# EAGLE design schachzwerg (EAGLE 7.6.0)
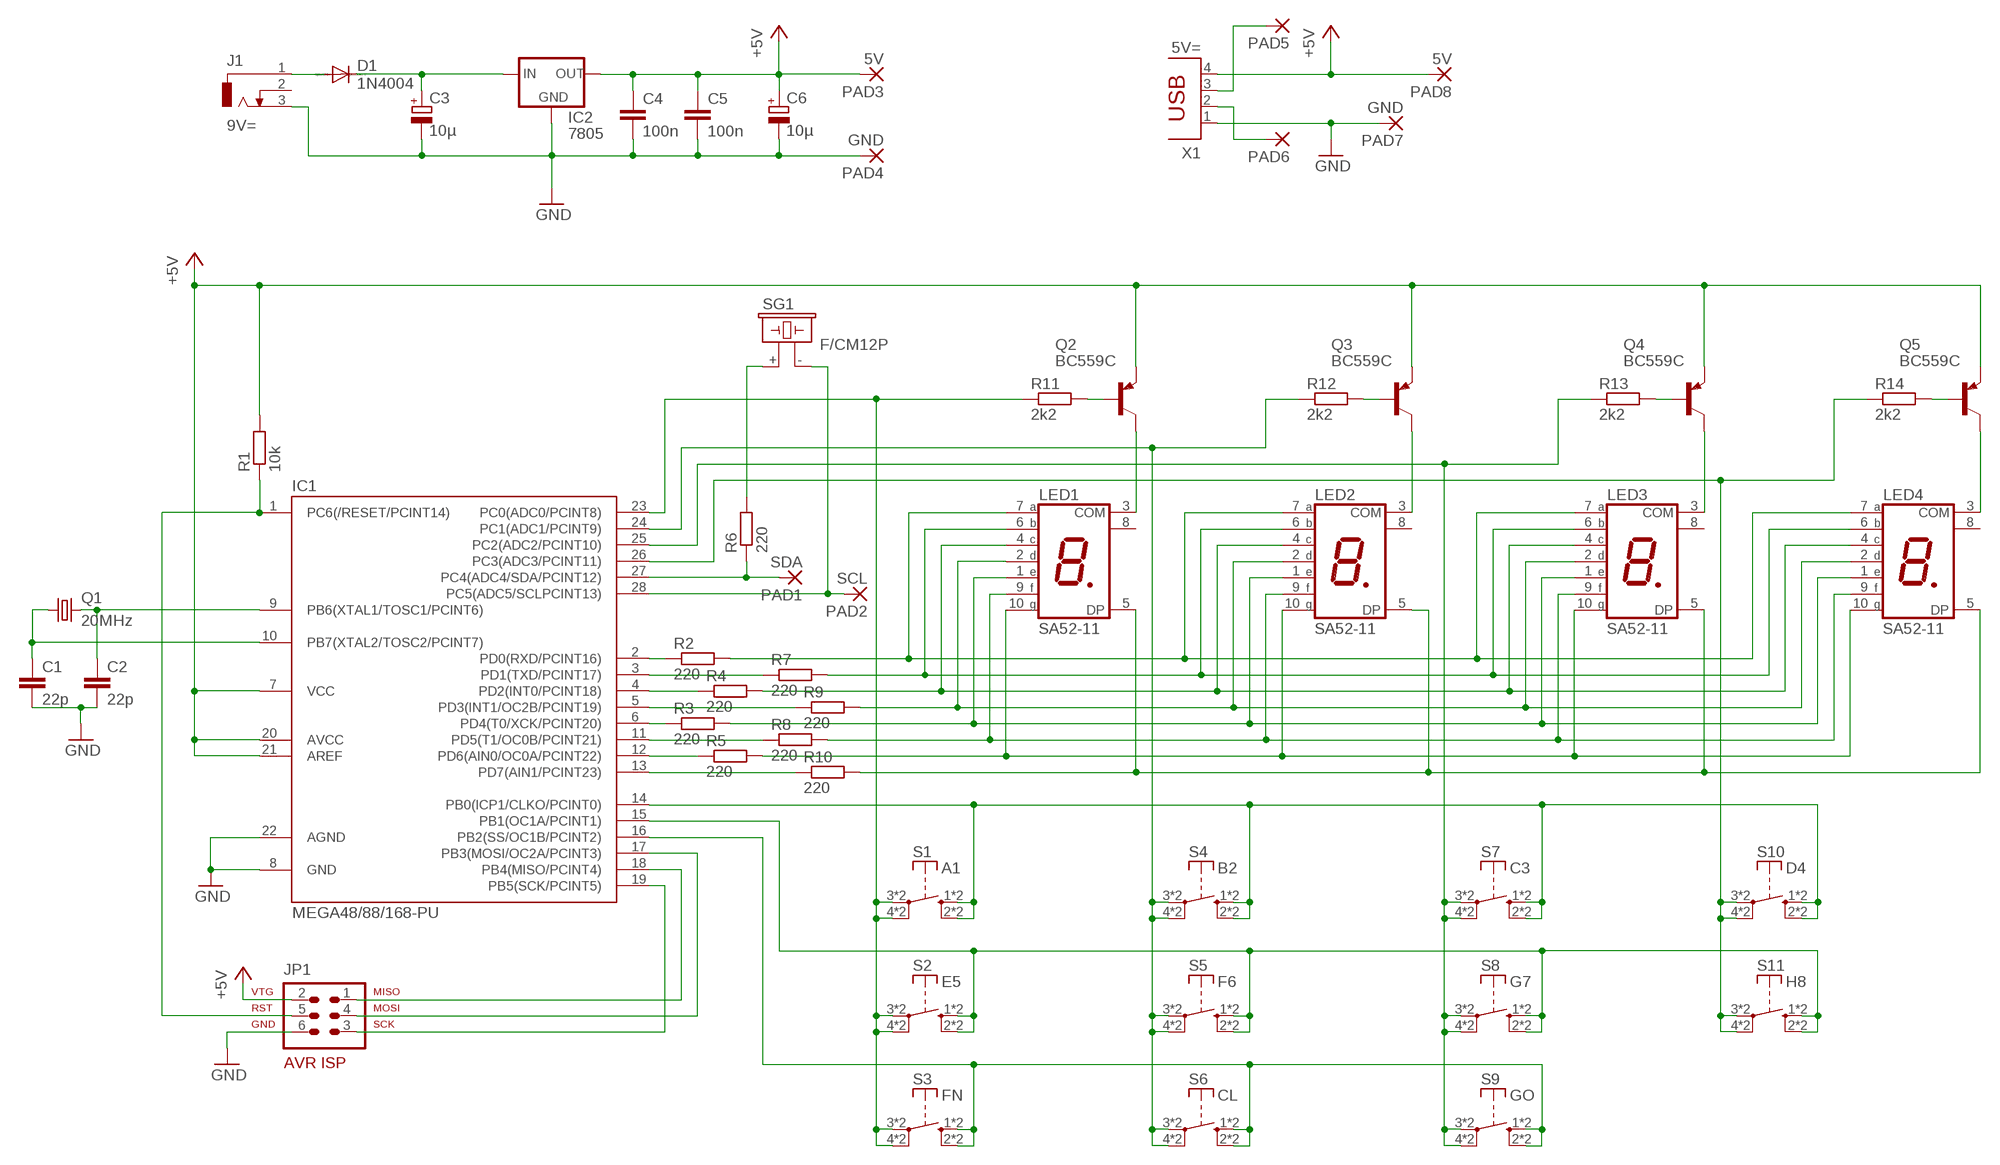
[diagram p0: schematic, sheet 1]

## Parts
C1  22p  C-EU025-025X050  [C025-025X050]
C2  22p  C-EU025-025X050  [C025-025X050]
C3  10µ  CPOL-EUE2.5-5  [E2,5-5]
C4  100n  C-EU025-025X050  [C025-025X050]
C5  100n  C-EU025-025X050  [C025-025X050]
C6  10µ  CPOL-EUE2.5-5  [E2,5-5]
D1  1N4004  [DO41-10]
IC1  MEGA48/88/168-PU  [DIL28-3]
IC2  7805  78XXS  [78XXS]
J1  9V=  DCJ0303  [DCJ0303]
JP1  AVR-ISP-6  [AVR-ISP-6]
LED1  SA52-11  7-SEG_SA52-11  [SA52-11]
LED2  SA52-11  7-SEG_SA52-11  [SA52-11]
LED3  SA52-11  7-SEG_SA52-11  [SA52-11]
LED4  SA52-11  7-SEG_SA52-11  [SA52-11]
PAD1  SDA  1,6/0,8  [1,6/0,8]
PAD2  SCL  1,6/0,8  [1,6/0,8]
PAD3  5V  1,6/0,8  [1,6/0,8]
PAD4  GND  1,6/0,8  [1,6/0,8]
PAD5  1,6/0,8  [1,6/0,8]
PAD6  1,6/0,8  [1,6/0,8]
PAD7  GND  1,6/0,8  [1,6/0,8]
PAD8  5V  1,6/0,8  [1,6/0,8]
Q1  20MHz  CRYSTALHC49S  [HC49/S]
Q2  BC559C  [TO92-EBC]
Q3  BC559C  [TO92-EBC]
Q4  BC559C  [TO92-EBC]
Q5  BC559C  [TO92-EBC]
R1  10k  R-EU_0204/7  [0204/7]
R2  220  R-EU_0204/7  [0204/7]
R3  220  R-EU_0204/7  [0204/7]
R4  220  R-EU_0204/7  [0204/7]
R5  220  R-EU_0204/7  [0204/7]
R6  220  R-EU_0204/7  [0204/7]
R7  220  R-EU_0204/7  [0204/7]
R8  220  R-EU_0204/7  [0204/7]
R9  220  R-EU_0204/7  [0204/7]
R10  220  R-EU_0204/7  [0204/7]
R11  2k2  R-EU_0204/7  [0204/7]
R12  2k2  R-EU_0204/7  [0204/7]
R13  2k2  R-EU_0204/7  [0204/7]
R14  2k2  R-EU_0204/7  [0204/7]
S1  A1  DT6  [DT6]
S2  E5  DT6  [DT6]
S3  FN  DT6  [DT6]
S4  B2  DT6  [DT6]
S5  F6  DT6  [DT6]
S6  CL  DT6  [DT6]
S7  C3  DT6  [DT6]
S8  G7  DT6  [DT6]
S9  GO  DT6  [DT6]
S10  D4  DT6  [DT6]
S11  H8  DT6  [DT6]
SG1  F/CM12P  [F/CM12P]
X1  5V=  PN87520  [PN87520]

## Nets
+5V: C4.1 C5.1 C6.+ IC1.7(VCC) IC1.20(AVCC) IC1.21(AREF) IC2.OUT JP1.2 PAD3.1(P) PAD8.1(P) Q2.E Q3.E Q4.E Q5.E R1.2 X1.4
GND: C1.2 C2.2 C3.- C4.2 C5.2 C6.- IC1.8(GND) IC1.22(AGND) IC2.GND J1.3 JP1.6 PAD4.1(P) PAD7.1(P) X1.1
N$1: IC1.2(PD0(RXD/PCINT16)) R2.1
N$2: IC1.3(PD1(TXD/PCINT17)) R7.1
N$3: IC1.4(PD2(INT0/PCINT18)) R4.1
N$4: IC1.5(PD3(INT1/OC2B/PCINT19)) R9.1
N$5: IC1.6(PD4(T0/XCK/PCINT20)) R3.1
N$6: IC1.11(PD5(T1/OC0B/PCINT21)) R8.1
N$7: IC1.12(PD6(AIN0/OC0A/PCINT22)) R5.1
N$8: IC1.13(PD7(AIN1/PCINT23)) R10.1
N$9: LED1.7(A) LED2.7(A) LED3.7(A) LED4.7(A) R2.2
N$10: LED1.6(B) LED2.6(B) LED3.6(B) LED4.6(B) R7.2
N$11: LED1.4(C) LED2.4(C) LED3.4(C) LED4.4(C) R4.2
N$12: LED1.2(D) LED2.2(D) LED3.2(D) LED4.2(D) R9.2
N$13: LED1.1(E) LED2.1(E) LED3.1(E) LED4.1(E) R3.2
N$14: LED1.9(F) LED2.9(F) LED3.9(F) LED4.9(F) R8.2
N$15: LED1.10(G) LED2.10(G) LED3.10(G) LED4.10(G) R5.2
N$16: LED1.5(DP) LED2.5(DP) LED3.5(DP) LED4.5(DP) R10.2
N$17: LED1.3(COM) Q2.C
N$18: LED2.3(COM) Q3.C
N$19: LED3.3(COM) Q4.C
N$20: LED4.3(COM) Q5.C
N$21: Q2.B R11.2
N$22: Q3.B R12.2
N$23: Q4.B R13.2
N$24: Q5.B R14.2
N$25: C2.1 IC1.9(PB6(XTAL1/TOSC1/PCINT6)) Q1.2
N$26: PAD6.1(P) X1.2
N$27: R6.2 SG1.+
N$28: IC1.28(PC5(ADC5/SCLPCINT13)) PAD2.1(P) SG1.-
N$29: D1.A J1.1
N$30: IC1.1(PC6(/RESET/PCINT14)) JP1.5 R1.1
N$31: IC1.19(PB5(SCK/PCINT5)) JP1.3
N$32: IC1.17(PB3(MOSI/OC2A/PCINT3)) JP1.4
N$33: IC1.18(PB4(MISO/PCINT4)) JP1.1
N$34: IC1.23(PC0(ADC0/PCINT8)) R11.1 S1.3(P) S1.4(P) S1.7(P) S1.8(P) S2.3(P) S2.4(P) S2.7(P) S2.8(P) S3.3(P) S3.4(P) S3.7(P) S3.8(P)
N$35: IC1.24(PC1(ADC1/PCINT9)) R12.1 S4.3(P) S4.4(P) S4.7(P) S4.8(P) S5.3(P) S5.4(P) S5.7(P) S5.8(P) S6.3(P) S6.4(P) S6.7(P) S6.8(P)
N$36: IC1.25(PC2(ADC2/PCINT10)) R13.1 S7.3(P) S7.4(P) S7.7(P) S7.8(P) S8.3(P) S8.4(P) S8.7(P) S8.8(P) S9.3(P) S9.4(P) S9.7(P) S9.8(P)
N$37: IC1.26(PC3(ADC3/PCINT11)) R14.1 S10.3(P) S10.4(P) S10.7(P) S10.8(P) S11.3(P) S11.4(P) S11.7(P) S11.8(P)
N$38: IC1.14(PB0(ICP1/CLKO/PCINT0)) S1.1(S) S1.2(S) S1.5(S) S1.6(S) S4.1(S) S4.2(S) S4.5(S) S4.6(S) S7.1(S) S7.2(S) S7.5(S) S7.6(S) S10.1(S) S10.2(S) S10.5(S) S10.6(S)
N$39: PAD5.1(P) X1.3
N$40: IC1.15(PB1(OC1A/PCINT1)) S2.1(S) S2.2(S) S2.5(S) S2.6(S) S5.1(S) S5.2(S) S5.5(S) S5.6(S) S8.1(S) S8.2(S) S8.5(S) S8.6(S) S11.1(S) S11.2(S) S11.5(S) S11.6(S)
N$41: IC1.16(PB2(SS/OC1B/PCINT2)) S3.1(S) S3.2(S) S3.5(S) S3.6(S) S6.1(S) S6.2(S) S6.5(S) S6.6(S) S9.1(S) S9.2(S) S9.5(S) S9.6(S)
N$42: C3.+ D1.C IC2.IN
N$43: C1.1 IC1.10(PB7(XTAL2/TOSC2/PCINT7)) Q1.1
N$45: IC1.27(PC4(ADC4/SDA/PCINT12)) PAD1.1(P) R6.1
Unconnected: J1.2 LED1.8(COM) LED2.8(COM) LED3.8(COM) LED4.8(COM)

## Library data of the parts
C1 C2 C4 C5 = rcl:C-EU: CAPACITOR, European symbol
C3 C6 = rcl:CPOL-EU: POLARIZED CAPACITOR, European symbol
D1 = diode:1N4004: DIODE general purpose rectifier, 1 A
IC1 = avr-5-4.16:MEGA48/88/168-PU
IC2 = v-reg:78XXS: VOLTAGE REGULATOR
J1 = con-jack:DCJ0303: DC POWER JACK Source: DCJ0303.pdf; OC_FARNELL: unknown; OC_NEWARK: unknown
JP1 = avr-5-4.16:AVR-ISP-6: AVR ISP-6 Serial Programming Header
LED1-LED4 = display-kingbright:7-SEG_: Kingbright 14.2mm (0.56 INCH) SINGLE DIGIT NUMERIC DUISPLAY Source: SA56-11EWA(Ver1189471036.pdf; OC_FARNELL: unknown; OC_NEWARK: unknown
PAD1-PAD8 = wirepad:1,6/0,8: THROUGH-HOLE PAD
Q1 = crystal:CRYSTAL: CRYSTAL; OC_FARNELL: 1667008; OC_NEWARK: unknown
Q2-Q5 = transistor-pnp:BC559*: PNP Transistror
R1-R14 = rcl:R-EU_: RESISTOR, European symbol
S1-S11 = switch-misc:DT: ITT SWITCH
SG1 = buzzer:F/CM12P: BUZZER Source: Buerklin; OC_FARNELL: unknown; OC_NEWARK: unknown
X1 = con-berg:PN87520: BERG USB connector; OC_FARNELL: unknown; OC_NEWARK: unknown

## Board
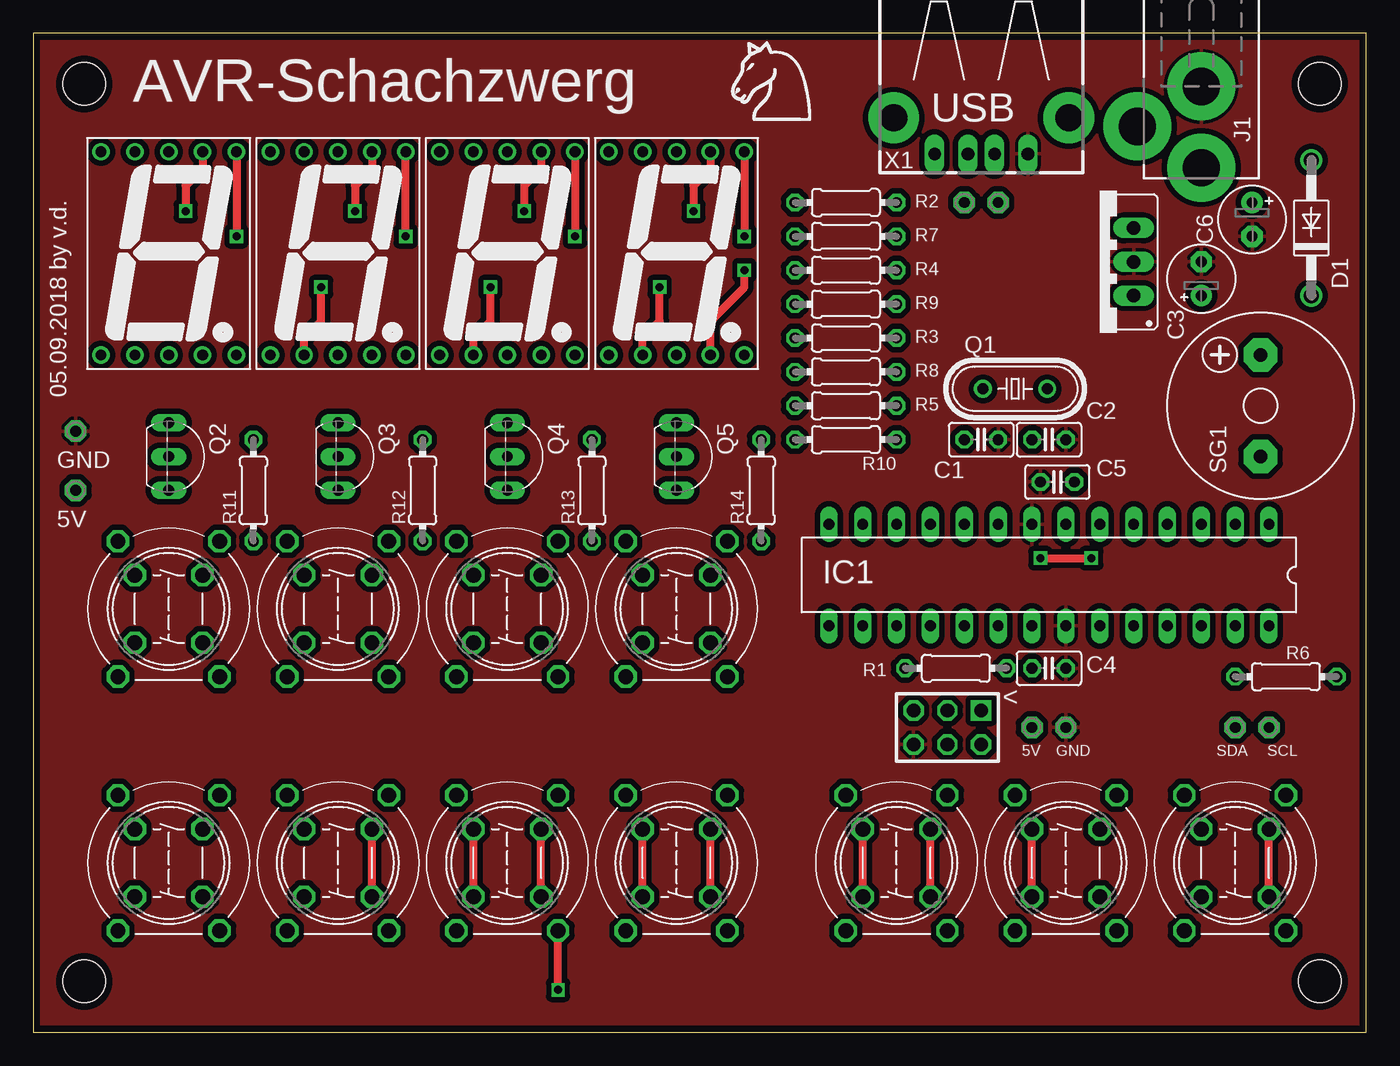
[diagram p1: board, top side]
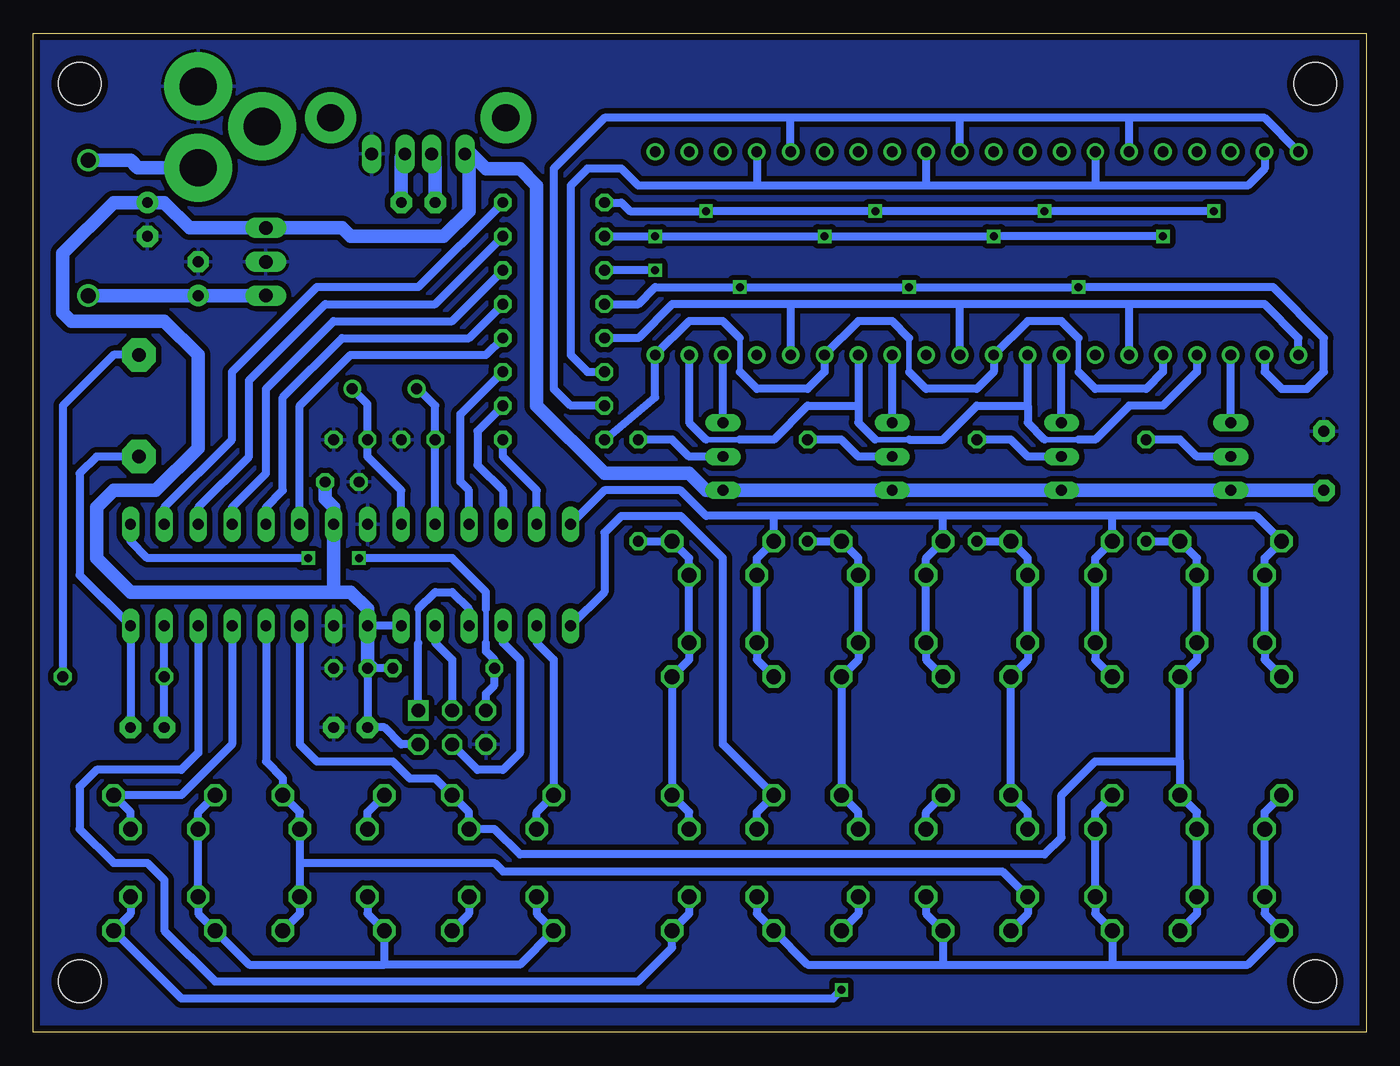
[diagram p2: board, bottom side, seen from below]

Size 100 x 74.92 mm. Coordinates in mm from the lower left corner, seen from the top.
Outline: 0,0 100,0 100,74.92 0,74.92 0,0
Copper layers (1*16): Top 0.035mm / dielectric 1.5mm / Bottom 0.035mm
Design rules "default *": minimum track width 10mil, minimum drill 16mil, track to track 8mil, track to pad 8mil, pad to pad 8mil, via to via 8mil, smd to smd 4mil, copper to edge 20mil, drill to drill 8mil, minimum pad ring 10mil, minimum via ring 8mil, stop-mask expansion 4mil, vias tented up to drill 0mil, thermal gap 10mil
Holes 3.2 mm at 3.81,71.12 3.81,3.81 96.52,3.81 96.52,71.12

### Footprints (pad centres in the part's own frame; a part is rotated, then mirrored left to right if it is on the bottom)
C025-025X050 = drill 0.813 octagon: 1 -1.27,0; 2 1.27,0
E2,5-5 = drill 0.813 pad 1.6: + -1.27,0 | drill 0.813 pad 1.6 octagon: - 1.27,0
DO41-10 = drill 1.118: A 5.08,0; C -5.08,0
DIL28-3 = drill 0.813 long: 1 -16.51,-3.81; 2 -13.97,-3.81; 3 -11.43,-3.81; 4 -8.89,-3.81; 5 -6.35,-3.81; 6 -3.81,-3.81; 7 -1.27,-3.81; 8 1.27,-3.81; 9 3.81,-3.81; 10 6.35,-3.81; 11 8.89,-3.81; 12 11.43,-3.81; 13 13.97,-3.81; 14 16.51,-3.81; 15 16.51,3.81; 16 13.97,3.81; 17 11.43,3.81; 18 8.89,3.81; 19 6.35,3.81; 20 3.81,3.81; 21 1.27,3.81; 22 -1.27,3.81; 23 -3.81,3.81; 24 -6.35,3.81; 25 -8.89,3.81; 26 -11.43,3.81; 27 -13.97,3.81; 28 -16.51,3.81
78XXS = drill 1.016 long: GND 0,-2.54; IN -2.54,-2.54; OUT 2.54,-2.54
DCJ0303 = drill 2.8 pad 5.08: 1 0,3.1; 2 4.8,0; 3 0,-3
AVR-ISP-6 = drill 1.016 square: 1 -2.54,-1.27 | drill 1.016 octagon: 2 -2.54,1.27; 3 0,-1.27; 4 0,1.27; 5 2.54,-1.27; 6 2.54,1.27
SA52-11 = drill 0.8: 1 -5.08,-7.62; 2 -2.54,-7.62; 3 0,-7.62; 4 2.54,-7.62; 5 5.08,-7.62; 6 5.08,7.62; 7 2.54,7.62; 8 0,7.62; 9 -2.54,7.62; 10 -5.08,7.62
1,6/0,8 = drill 0.813 pad 1.6 octagon: 1 0,0
HC49/S = drill 0.813: 1 -2.413,0; 2 2.413,0
TO92-EBC = drill 0.813 long: B 0,-1.27; C -2.54,-1.27; E 2.54,-1.27
0204/7 = drill 0.813 octagon: 1 -3.81,0; 2 3.81,0
DT6 = drill 1.118 octagon: 1 -2.54,2.54; 2 2.54,2.54; 3 2.54,-2.54; 4 -2.54,-2.54; 5 -5.08,3.81; 6 5.08,3.81; 7 5.08,-3.81; 8 -5.08,-3.81
F/CM12P = drill 1.016 pad 2.54 octagon: + 3.81,0; - -3.81,0
PN87520 = drill 0.95 long: 1 -3.5,2.71; 2 -1,2.71; 3 1,2.71; 4 3.5,2.71 | drill 2.032 pad 3.81: P$3 -6.572,0; P$4 6.572,0

### Placement (x,y rotation side)
C1  71.12,44.45 0 top
C2  76.2,44.45 0 top
C3  87.63,56.52 90 top
C4  76.2,27.3 0 top
C5  76.83,41.27 180 top
C6  91.44,60.96 270 top
D1  95.89,60.33 90 top
IC1  76.2,34.29 180 top
IC2  80.01,57.78 90 top
J1  87.63,67.94 180 top
JP1  68.58,22.86 180 top
LED1  10.16,58.42 0 top
LED2  22.86,58.42 0 top
LED3  35.56,58.42 0 top
LED4  48.26,58.42 0 top
PAD1  90.17,22.86 0 top
PAD2  92.71,22.86 0 top
PAD3  74.93,22.86 0 top
PAD4  77.47,22.86 0 top
PAD5  69.85,62.23 0 top
PAD6  72.39,62.23 0 top
PAD7  3.17,45.09 0 top
PAD8  3.17,40.64 0 top
Q1  73.66,48.26 0 top
Q2  11.43,43.18 270 top
Q3  24.13,43.18 270 top
Q4  36.83,43.18 270 top
Q5  49.53,43.18 270 top
R1  69.22,27.3 0 top
R2  60.96,62.23 180 top
R3  60.96,52.07 180 top
R4  60.96,57.15 180 top
R5  60.96,46.99 180 top
R6  93.98,26.67 0 top
R7  60.96,59.69 180 top
R8  60.96,49.53 180 top
R9  60.96,54.61 180 top
R10  60.96,44.45 180 top
R11  16.51,40.64 90 top
R12  29.21,40.64 90 top
R13  41.91,40.64 90 top
R14  54.61,40.64 90 top
S1  10.16,31.75 90 top
S2  10.16,12.7 90 top
S3  64.77,12.7 90 top
S4  22.86,31.75 90 top
S5  22.86,12.7 90 top
S6  77.47,12.7 90 top
S7  35.56,31.75 90 top
S8  35.56,12.7 90 top
S9  90.17,12.7 90 top
S10  48.26,31.75 90 top
S11  48.26,12.7 90 top
SG1  92.08,46.99 90 top
X1  71.12,68.58 180 top

### Tracks (layer width: path | path; a pad name or v marks a point on that pad's centre or on a via)
+5V
  Bottom 0.61: IC1.20 IC1.21 | C4.1 PAD3.1 73.66,22.86 72.39,21.59 JP1.2 | R1.2 74.3,27.3 74.93,27.94
  Bottom 1.016: C4.1 74.93,27.94 IC1.21 74.93,31.75 76.2,33.02 77.47,33.02 | 77.47,33.02 IC1.7 77.47,39.37 78.11,40.01 C5.1 | 67.31,66.04 67.45,66.04 X1.4 | 67.31,66.04 67.31,61.59 69.22,59.69 76.2,59.69 76.83,60.33 IC2.OUT 88.27,60.33 90.17,62.23 C6.+ 93.98,62.23 97.79,58.42 97.79,53.98 97.16,53.34 90.17,53.34 87.63,50.8 87.63,43.81 90.81,40.64 93.98,40.64 95.25,39.37 95.25,35.56 92.71,33.02 77.47,33.02 | 67.31,66.04 66.04,64.77 63.5,64.77 62.23,63.5 62.23,46.99 57.15,41.91 50.8,41.91 49.53,40.64 Q5.E Q4.E Q3.E Q2.E PAD8.1
GND
  pour Bottom (isolate 0.406): 0,0 100.33,0 100.33,74.93 0,74.93
  pour Top (isolate 0.406): 0,74.93 0,0 100.33,0 100.33,74.93
N$1
  Bottom 0.61: R2.1 71.12,55.88 78.74,55.88 85.09,49.53 85.09,44.45 90.17,39.37 IC1.2
N$2
  Bottom 0.61: R7.1 69.85,54.61 78.11,54.61 83.82,48.9 83.82,43.18 87.63,39.37 IC1.3
N$3
  Bottom 0.61: R4.1 68.58,53.34 77.47,53.34 82.55,48.26 82.55,41.91 85.09,39.37 IC1.4
N$4
  Bottom 0.61: R9.1 67.31,52.07 76.83,52.07 81.28,47.62 81.28,40.64 82.55,39.37 IC1.5
N$5
  Bottom 0.61: IC1.6 80.01,46.99 76.2,50.8 66.04,50.8 R3.1
N$6
  Bottom 0.61: R8.1 67.94,46.35 67.94,41.27 67.31,40.64 IC1.11
N$7
  Bottom 0.61: R5.1 66.67,45.09 66.67,42.55 64.77,40.64 IC1.12
N$8
  Bottom 0.61: IC1.13 62.23,40.64 64.77,43.18 R10.1
N$9  (via drill 0.6)
  Top 0.61: LED4.7 50.8,64.77 49.53,63.5 v49.53,61.59 | LED3.7 38.1,64.77 36.83,63.5 v36.83,61.59 | LED2.7 25.4,64.77 24.13,63.5 v24.13,61.59 | LED1.7 12.7,64.77 11.43,63.5 v11.43,61.59
  Bottom 0.61: v11.43,61.59 v24.13,61.59 v36.83,61.59 v49.53,61.59 55.24,61.59 55.88,62.23 R2.2
N$10  (via drill 0.6)
  Top 0.61: LED1.6 v15.24,59.69 | v27.94,59.69 LED2.6 | LED3.6 v40.64,59.69 | LED4.6 v53.34,59.69
  Bottom 0.61: v15.24,59.69 v27.94,59.69 v40.64,59.69 v53.34,59.69 R7.2
N$11  (via drill 0.6)
  Top 0.61: LED4.4 50.8,53.34 53.34,55.88 v53.34,57.15
  Bottom 0.406: 21.59,44.45 24.13,44.45 | 36.83,44.45 34.29,44.45 | 46.99,44.45 49.53,44.45
  Bottom 0.61: LED1.4 12.7,49.53 15.24,46.99 17.78,46.99 20.32,44.45 21.59,44.45 | 24.13,44.45 25.4,45.72 25.4,46.99 | 25.4,46.99 LED2.4 | LED3.4 38.1,46.99 | 36.83,44.45 38.1,45.72 38.1,46.99 | 25.4,46.99 29.21,46.99 31.75,44.45 34.29,44.45 | LED4.4 50.8,45.72 49.53,44.45 | 38.1,46.99 41.91,46.99 44.45,44.45 46.99,44.45 | v53.34,57.15 R4.2
N$12  (via drill 0.6)
  Top 0.61: LED2.2 20.32,52.07 21.59,53.34 v21.59,55.88 | LED3.2 33.02,52.07 34.29,53.34 v34.29,55.88 | LED4.2 45.72,52.07 46.99,53.34 v46.99,55.88
  Bottom 0.61: R9.2 54.61,54.61 53.34,55.88 v46.99,55.88 v34.29,55.88 v21.59,55.88 6.99,55.88 3.17,52.07 3.17,49.53 4.45,48.26 6.35,48.26 7.62,49.53 LED1.2
N$13
  Bottom 0.61: LED1.1 5.08,52.07 7.62,54.61 17.78,54.61 | LED2.1 17.78,54.61 | 17.78,54.61 30.48,54.61 | 30.48,54.61 43.18,54.61 | 43.18,54.61 LED4.1 | LED3.1 30.48,54.61 | 43.18,54.61 52.07,54.61 54.61,52.07 R3.2
N$14
  Bottom 0.61: 20.32,63.5 8.89,63.5 7.62,64.77 LED1.9 | 20.32,63.5 33.02,63.5 | 33.02,63.5 45.72,63.5 | 45.72,63.5 54.61,63.5 55.88,64.77 58.42,64.77 59.69,63.5 59.69,50.8 58.42,49.53 R8.2 | LED2.9 20.32,63.5 | LED3.9 33.02,63.5 | LED4.9 45.72,63.5
N$15
  Bottom 0.61: 17.78,68.58 7.62,68.58 LED1.10 | 17.78,68.58 30.48,68.58 | 30.48,68.58 43.18,68.58 | 43.18,68.58 57.15,68.58 60.96,64.77 60.96,48.26 59.69,46.99 R5.2 | LED2.10 17.78,68.58 | LED3.10 30.48,68.58 | LED4.10 43.18,68.58
N$16
  Bottom 0.406: 21.59,49.53 21.59,52.07 | 34.29,49.53 34.29,52.07 | 46.99,49.53 46.99,52.07
  Bottom 0.61: LED1.5 15.24,49.53 16.51,48.26 20.32,48.26 21.59,49.53 | 21.59,52.07 22.86,53.34 25.4,53.34 LED2.5 27.94,49.53 29.21,48.26 33.02,48.26 34.29,49.53 | 34.29,52.07 35.56,53.34 38.1,53.34 LED3.5 40.64,49.53 41.91,48.26 45.72,48.26 46.99,49.53 | 46.99,52.07 48.26,53.34 50.8,53.34 LED4.5 53.34,47.62 R10.2
N$17
  Bottom 0.61: Q2.C LED1.3
N$18
  Bottom 0.61: Q3.C LED2.3
N$19
  Bottom 0.61: Q4.C LED3.3
N$20
  Bottom 0.61: Q5.C LED4.3
N$21
  Bottom 0.61: Q2.B 12.7,43.18 13.97,44.45 R11.2
N$22
  Bottom 0.61: Q3.B 25.4,43.18 26.67,44.45 R12.2
N$23
  Bottom 0.61: Q4.B 38.1,43.18 39.37,44.45 R13.2
N$24
  Bottom 0.61: Q5.B 50.8,43.18 52.07,44.45 R14.2
N$25
  Bottom 0.61: IC1.9 72.39,40.64 74.93,43.18 C2.1 74.93,47.12 Q1.2
N$26
  Bottom 1.016: PAD6.1 72.39,65.6 X1.2
N$27
  Bottom 0.61: SG1.+ 93.98,50.8 97.79,46.99 R6.2
N$28
  Bottom 0.61: PAD2.1 IC1.28 96.52,34.29 96.52,41.91 95.25,43.18 SG1.-
N$29
  Bottom 1.016: J1.1 92.15,64.84 92.71,65.41 D1.A
N$30  (via drill 0.6)
  Top 0.61: v75.56,35.56 v79.38,35.56
  Bottom 0.406: 66.04,29.21 66.04,31.75
  Bottom 0.61: v79.38,35.56 91.44,35.56 92.71,36.83 IC1.1 | 66.04,31.75 66.04,33.02 68.58,35.56 v75.56,35.56 | JP1.5 66.04,25.4 65.41,26.04 R1.1 65.41,27.94 66.04,28.57 66.04,29.21
N$31
  Bottom 0.61: IC1.19 69.85,29.21 68.58,27.94 JP1.3
N$32
  Bottom 0.61: IC1.17 64.77,29.21 63.5,27.94 63.5,20.95 64.77,19.68 66.67,19.68 JP1.4
N$33
  Bottom 0.406: 71.12,29.21 71.12,31.75
  Bottom 0.61: JP1.1 71.12,29.21 | 71.12,31.75 69.85,33.02 68.58,33.02 67.31,31.75 IC1.18
N$34
  Top 0.61: S3.4 S3.3
  Bottom 0.61: 13.97,20.32 S2.7 | IC1.23 80.01,21.59 78.74,20.32 73.03,20.32 71.75,19.05 69.85,19.05 S3.7 | S3.3 65.41,15.24 63.5,13.34 24.13,13.34 22.86,14.61 22.86,17.78 20.32,20.32 13.97,20.32 | S2.4 S2.3 | S1.4 S1.3 | R11.1 S1.7 | 13.97,20.32 S1.8
N$35
  Top 0.61: S5.4 S5.3
  Bottom 0.61: IC1.24 82.55,20.32 81.28,19.05 S6.7 | S4.4 S4.3 | 80.01,12.7 S6.4 | S6.3 80.01,12.7 | 80.01,12.7 65.41,12.7 64.77,12.06 27.3,12.06 S5.4 | R12.1 S4.7 | S5.7 S4.8
N$36  (via drill 0.6)
  Top 0.61: S8.4 S8.3 | S9.4 S9.3 | v39.37,3.17 S8.8
  Bottom 0.61: IC1.25 85.09,21.59 88.9,17.78 S9.7 | S9.8 88.9,2.54 40.01,2.54 v39.37,3.17 | S7.4 S7.3 | R13.1 S7.7 | S7.8 S8.7
N$37
  Top 0.61: S11.4 S11.3
  Bottom 0.61: S10.4 S10.3 | R14.1 S10.7 | S10.8 S11.7 | S11.8 52.07,6.35 54.61,3.81 86.36,3.81 90.17,7.62 90.17,11.43 91.44,12.7 93.98,12.7 96.52,15.24 96.52,18.41 95.25,19.68 88.9,19.68 87.63,20.95 IC1.26
N$38
  Bottom 0.61: 19.05,38.73 8.26,38.73 S1.6 | 19.05,38.73 31.75,38.73 | 31.75,38.73 44.45,38.73 | 44.45,38.73 49.53,38.73 51.44,40.64 57.15,40.64 IC1.14 | S4.6 19.05,38.73 | S10.1 S10.2 | S1.1 S1.2 | S4.1 S4.2 | S10.6 44.45,38.73 | S7.1 S7.2 | 33.02,35.56 S7.6 31.75,38.73
N$39
  Bottom 1.016: PAD5.1 69.85,65.6 X1.3
N$40
  Top 0.61: S8.1 S8.2 | S11.1 S11.2
  Bottom 0.61: S5.5 19.05,5.08 | 19.05,5.08 8.89,5.08 S2.5 | S8.5 31.75,5.08 | 31.75,5.08 19.05,5.08 | 31.75,5.08 41.91,5.08 S11.5 | S11.6 48.26,21.59 48.26,35.56 51.44,38.73 55.88,38.73 57.15,37.47 57.15,33.02 IC1.15 | S2.1 S2.2 | S5.1 S5.2
N$41
  Top 0.61: S3.1 S3.2 | S6.1 S6.2
  Bottom 0.61: IC1.16 62.23,29.21 60.96,27.94 S3.6 | S9.1 S9.2 | S3.5 63.5,5.08 73.66,5.08 | S9.5 83.82,5.08 73.66,5.08 | 73.66,5.08 S6.5
N$42
  Bottom 1.016: IC2.IN C3.+ D1.C
N$43
  Bottom 0.61: IC1.10 C1.1 69.85,46.99 71.12,48.26 Q1.1
N$45
  Bottom 0.61: PAD1.1 R6.1 IC1.27

### Text on the board
tNames: AVR-Schachzwerg | 05.09.2018 by v.d. | <